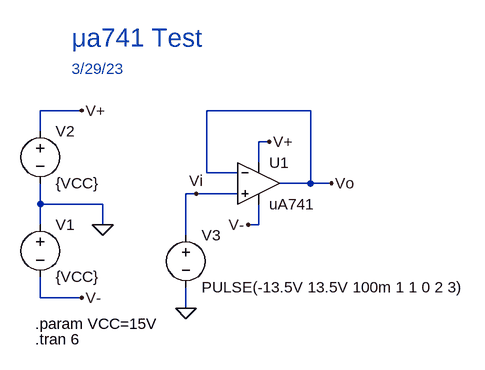
[diagram p0: schematic uA741_Tester.asc]
uA741_Tester.asc, the LTspice schematic file:
Version 4
SHEET 1 880 680
WIRE 0 144 -64 144
WIRE 352 144 192 144
WIRE -64 176 -64 144
WIRE 288 192 272 192
WIRE 272 224 272 192
WIRE 192 240 192 144
WIRE 240 240 192 240
WIRE 352 256 352 144
WIRE 352 256 304 256
WIRE 384 256 352 256
WIRE 176 272 160 272
WIRE 240 272 176 272
WIRE -64 288 -64 256
WIRE 32 288 -64 288
WIRE -64 320 -64 288
WIRE 32 320 32 288
WIRE 272 320 272 288
WIRE 272 320 256 320
WIRE 160 336 160 272
WIRE -64 432 -64 400
WIRE 0 432 -64 432
WIRE 160 448 160 416
FLAG 32 320 0
FLAG 0 144 V+
FLAG 0 432 V-
FLAG 288 192 V+
FLAG 256 320 V-
FLAG 160 448 0
FLAG 384 256 Vo
FLAG 176 272 Vi
SYMBOL uA741 272 192 R0
SYMATTR InstName U1
SYMBOL voltage -64 304 R0
SYMATTR InstName V1
SYMATTR Value {VCC}
SYMBOL voltage -64 160 R0
SYMATTR InstName V2
SYMATTR Value {VCC}
SYMBOL voltage 160 320 R0
WINDOW 123 0 0 Left 0
WINDOW 39 0 0 Left 0
SYMATTR InstName V3
SYMATTR Value PULSE(-13.5V 13.5V 100m 1 1 0 2 3)
TEXT -16 32 Left 4 ;μa741 Test
TEXT -16 80 Left 2 ;3/29/23
TEXT -72 472 Left 2 !.param VCC=15V
TEXT -72 496 Left 2 !.tran 6

The netlist it stands for:
* uA741_Tester.asc
* U1: uA741 (symbol uA741 not available, pins judged from their places): In+=Vi In-=Vo V+=V+ V-=V- OUT=Vo
V1 0 V- {VCC}
V2 V+ 0 {VCC}
V3 Vi 0 PULSE(-13.5V 13.5V 100m 1 1 0 2 3)
* μa741 Test
* 3/29/23
.param VCC=15V
.tran 6
.backanno
.end